# EAGLE design Output_v1_0 (EAGLE 9.6.2)
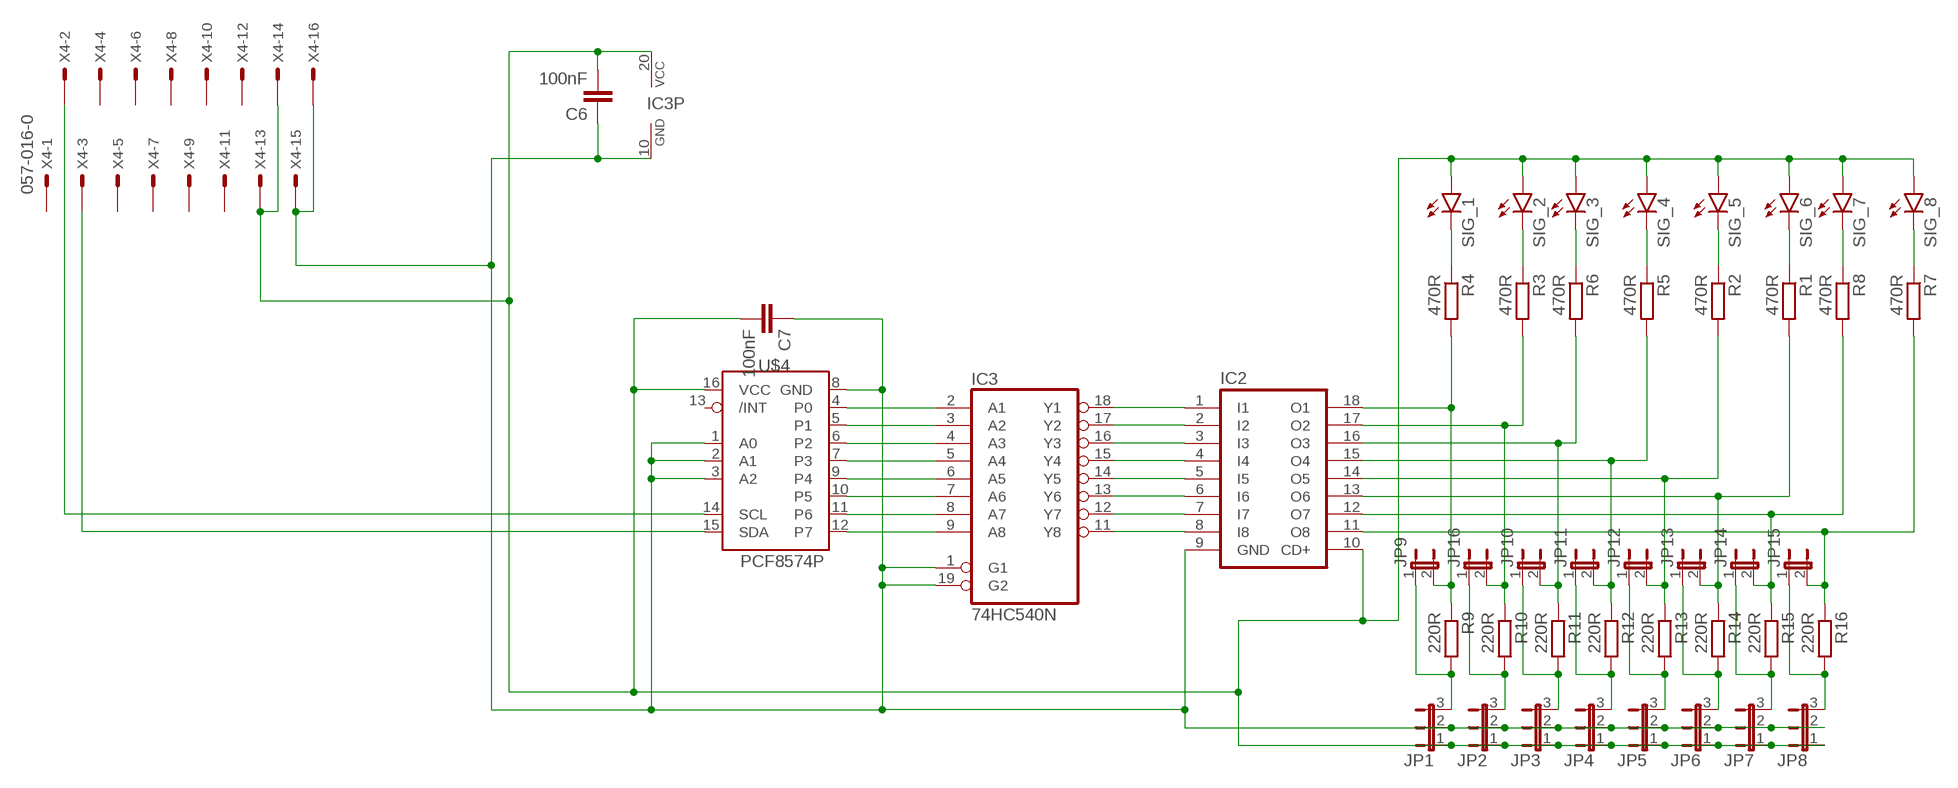
[diagram p0: schematic, sheet 1]

## Parts
C6  100nF  C-EU025-024X044  [C025-024X044]
C7  100nF  C-EU025-024X044  [C025-024X044]
IC2  ULN2803A  [DIL18]
IC3  74HC540N  [DIL20]
JP1  JP2E  [JP2]
JP2  JP2E  [JP2]
JP3  JP2E  [JP2]
JP4  JP2E  [JP2]
JP5  JP2E  [JP2]
JP6  JP2E  [JP2]
JP7  JP2E  [JP2]
JP8  JP2E  [JP2]
JP9  JP1E  [JP1]
JP10  JP1E  [JP1]
JP11  JP1E  [JP1]
JP12  JP1E  [JP1]
JP13  JP1E  [JP1]
JP14  JP1E  [JP1]
JP15  JP1E  [JP1]
JP16  JP1E  [JP1]
R1  470R  R-EU_0309/10  [0309/10]
R2  470R  R-EU_0309/10  [0309/10]
R3  470R  R-EU_0309/10  [0309/10]
R4  470R  R-EU_0309/10  [0309/10]
R5  470R  R-EU_0309/10  [0309/10]
R6  470R  R-EU_0309/10  [0309/10]
R7  470R  R-EU_0309/10  [0309/10]
R8  470R  R-EU_0309/10  [0309/10]
R9  220R  R-EU_0309/10  [0309/10]
R10  220R  R-EU_0309/10  [0309/10]
R11  220R  R-EU_0309/10  [0309/10]
R12  220R  R-EU_0309/10  [0309/10]
R13  220R  R-EU_0309/10  [0309/10]
R14  220R  R-EU_0309/10  [0309/10]
R15  220R  R-EU_0309/10  [0309/10]
R16  220R  R-EU_0309/10  [0309/10]
SIG_1  LED3MM  [LED3MM]
SIG_2  LED3MM  [LED3MM]
SIG_3  LED3MM  [LED3MM]
SIG_4  LED3MM  [LED3MM]
SIG_5  LED3MM  [LED3MM]
SIG_6  LED3MM  [LED3MM]
SIG_7  LED3MM  [LED3MM]
SIG_8  LED3MM  [LED3MM]
U$4  PCF8574P  [DIL16]
X4  057-016-0  [057-016-0]

## Nets
GND1: C6.1 C7.1 IC2.9(GND) IC3.1(G1) IC3.10(GND) IC3.19(G2) JP1.2 JP2.2 JP3.2 JP4.2 JP5.2 JP6.2 JP7.2 JP8.2 U$4.1(A0) U$4.2(A1) U$4.3(A2) U$4.8(GND) X4.15 X4.16
N$1: JP1.3 JP9.1 R9.2
N$2: IC2.13(O6) JP13.2 R1.2 R14.1
N$3: R2.1 SIG_5.K(C)
N$4: R1.1 SIG_6.K(C)
N$5: IC2.12(O7) JP14.2 R8.2 R15.1
N$6: U$4.15(SDA) X4.3
N$7: R8.1 SIG_7.K(C)
N$8: R7.1 SIG_8.K(C)
N$9: JP2.3 JP16.1 R10.2
N$10: JP3.3 JP10.1 R11.2
N$11: JP4.3 JP11.1 R12.2
N$12: IC2.8(I8) IC3.11(Y8)
N$13: JP5.3 JP12.1 R13.2
N$14: IC2.7(I7) IC3.12(Y7)
N$15: IC2.6(I6) IC3.13(Y6)
N$16: IC2.5(I5) IC3.14(Y5)
N$17: IC2.4(I4) IC3.15(Y4)
N$18: IC2.3(I3) IC3.16(Y3)
N$19: IC2.2(I2) IC3.17(Y2)
N$20: IC2.1(I1) IC3.18(Y1)
N$21: IC3.2(A1) U$4.4(P0)
N$22: IC3.3(A2) U$4.5(P1)
N$23: IC3.4(A3) U$4.6(P2)
N$24: IC3.5(A4) U$4.7(P3)
N$25: IC3.6(A5) U$4.9(P4)
N$26: IC3.7(A6) U$4.10(P5)
N$27: IC3.8(A7) U$4.11(P6)
N$28: IC3.9(A8) U$4.12(P7)
N$29: IC2.18(O1) JP9.2 R4.2 R9.1
N$30: JP6.3 JP13.1 R14.2
N$31: IC2.17(O2) JP16.2 R3.2 R10.1
N$32: JP7.3 JP14.1 R15.2
N$33: JP8.3 JP15.1 R16.2
N$35: U$4.14(SCL) X4.2
N$36: R4.1 SIG_1.K(C)
N$37: R3.1 SIG_2.K(C)
N$38: IC2.11(O8) JP15.2 R7.2 R16.1
N$41: IC2.16(O3) JP10.2 R6.2 R11.1
N$42: IC2.15(O4) JP11.2 R5.2 R12.1
N$43: IC2.14(O5) JP12.2 R2.2 R13.1
N$53: R6.1 SIG_3.K(C)
N$54: R5.1 SIG_4.K(C)
VCC5.0: C6.2 C7.2 IC2.10(CD+) IC3.20(VCC) JP1.1 JP2.1 JP3.1 JP4.1 JP5.1 JP6.1 JP7.1 JP8.1 SIG_1.A SIG_2.A SIG_3.A SIG_4.A SIG_5.A SIG_6.A SIG_7.A SIG_8.A U$4.16(VCC) X4.13 X4.14
Unconnected: U$4.13(/INT) X4.1 X4.4 X4.5 X4.6 X4.7 X4.8 X4.9 X4.10 X4.11 X4.12

## Library data of the parts
C6 C7 = resistor:C-EU: CAPACITOR, European symbol
IC2 = uln-udn:ULN2803A: DRIVER ARRAY
IC3 = 74xx-eu:74*540: Inverting Octal BUFFER and LINE DRIVER, 3-state
JP1-JP8 = jumper:JP2E: JUMPER
JP9-JP16 = jumper:JP1E: JUMPER
R1-R16 = resistor:R-EU_: RESISTOR, European symbol
SIG_1-SIG_8 = led:LED: LED OSRAM: - CHIPLED LG R971, LG N971, LY N971, LG Q971, LY Q971, LO R971, LY R971 LH N974, LH R974 LS Q976, LO Q976, LY Q976 LO Q996 - Hyper CHIPLED LW Q18S LB Q993, LB Q99A, LB R99A - SideLED LS A670, LO A670, LY A670, LG A670, LP A670 LB A673, LV A673, LT A673, LW A673 LH A674 LY A675 LS A676, LA A676, LO A676, LY A676, LW A676 LS A679, LY A679, LG A679 - Hyper Micro SIDELED® LS Y876, LA Y876, LO Y876, LY Y876 LT Y87S - SmartLED LW L88C, LW L88S LB L89C, LB L89S, LG L890 LS L89K, LO L89K, LY L89K LS L896, LA L896, LO L896, LY L896 - TOPLED LS T670, LO T670, LY T670, LG T670, LP T670 LSG T670, LSP T670, LSY T670, LOP T670, LYG T670 LG T671, LOG T671, LSG T671 LB T673, LV T673, LT T673, LW T673 LH T674 LS T676, LA T676, LO T676, LY T676, LB T676, LH T676, LSB T676, LW T676 LB T67C, LV T67C, LT T67C, LS T67K, LO T67K, LY T67K, LW E67C LS E67B, LA E67B, LO E67B, LY E67B, LB E67C, LV E67C, LT E67C LW T67C LS T679, LY T679, LG T679 LS T770, LO T770, LY T770, LG T770, LP T770 LB T773, LV T773, LT T773, LW T773 LH T774 LS E675, LA E675, LY E675, LS T675 LS T776, LA T776, LO T776, LY T776, LB T776 LHGB T686 LT T68C, LB T68C - Hyper Mini TOPLED® LB M676 - Mini TOPLED Santana® LG M470 LS M47K, LO M47K, LY M47K Source: http://www.osram.convergy.de LUXEON: - LUMILED® LXK2-PW12-R00, LXK2-PW12-S00, LXK2-PW14-U00, LXK2-PW14-V00 LXK2-PM12-R00, LXK2-PM12-S00, LXK2-PM14-U00 LXK2-PE12-Q00, LXK2-PE12-R00, LXK2-PE12-S00, LXK2-PE14-T00, LXK2-PE14-U00 LXK2-PB12-K00, LXK2-PB12-L00, LXK2-PB12-M00, LXK2-PB14-N00, LXK2-PB14-P00, LXK2-PB14-Q00 LXK2-PR12-L00, LXK2-PR12-M00, LXK2-PR14-Q00, LXK2-PR14-R00 LXK2-PD12-Q00, LXK2-PD12-R00, LXK2-PD12-S00 LXK2-PH12-R00, LXK2-PH12-S00 LXK2-PL12-P00, LXK2-PL12-Q00, LXK2-PL12-R00 Source: www.luxeon.com KINGBRIGHT: KA-3528ASYC Source: www.kingbright.com
U$4 = i2c:PCF8574: Remote 8-Bit I/O Expander for I²C Bus
X4 = con-panduit:057-016-: CONNECTOR 10-pin series 057 contact pc board low profile headers; OC_FARNELL: unknown; OC_NEWARK: unknown

## Board
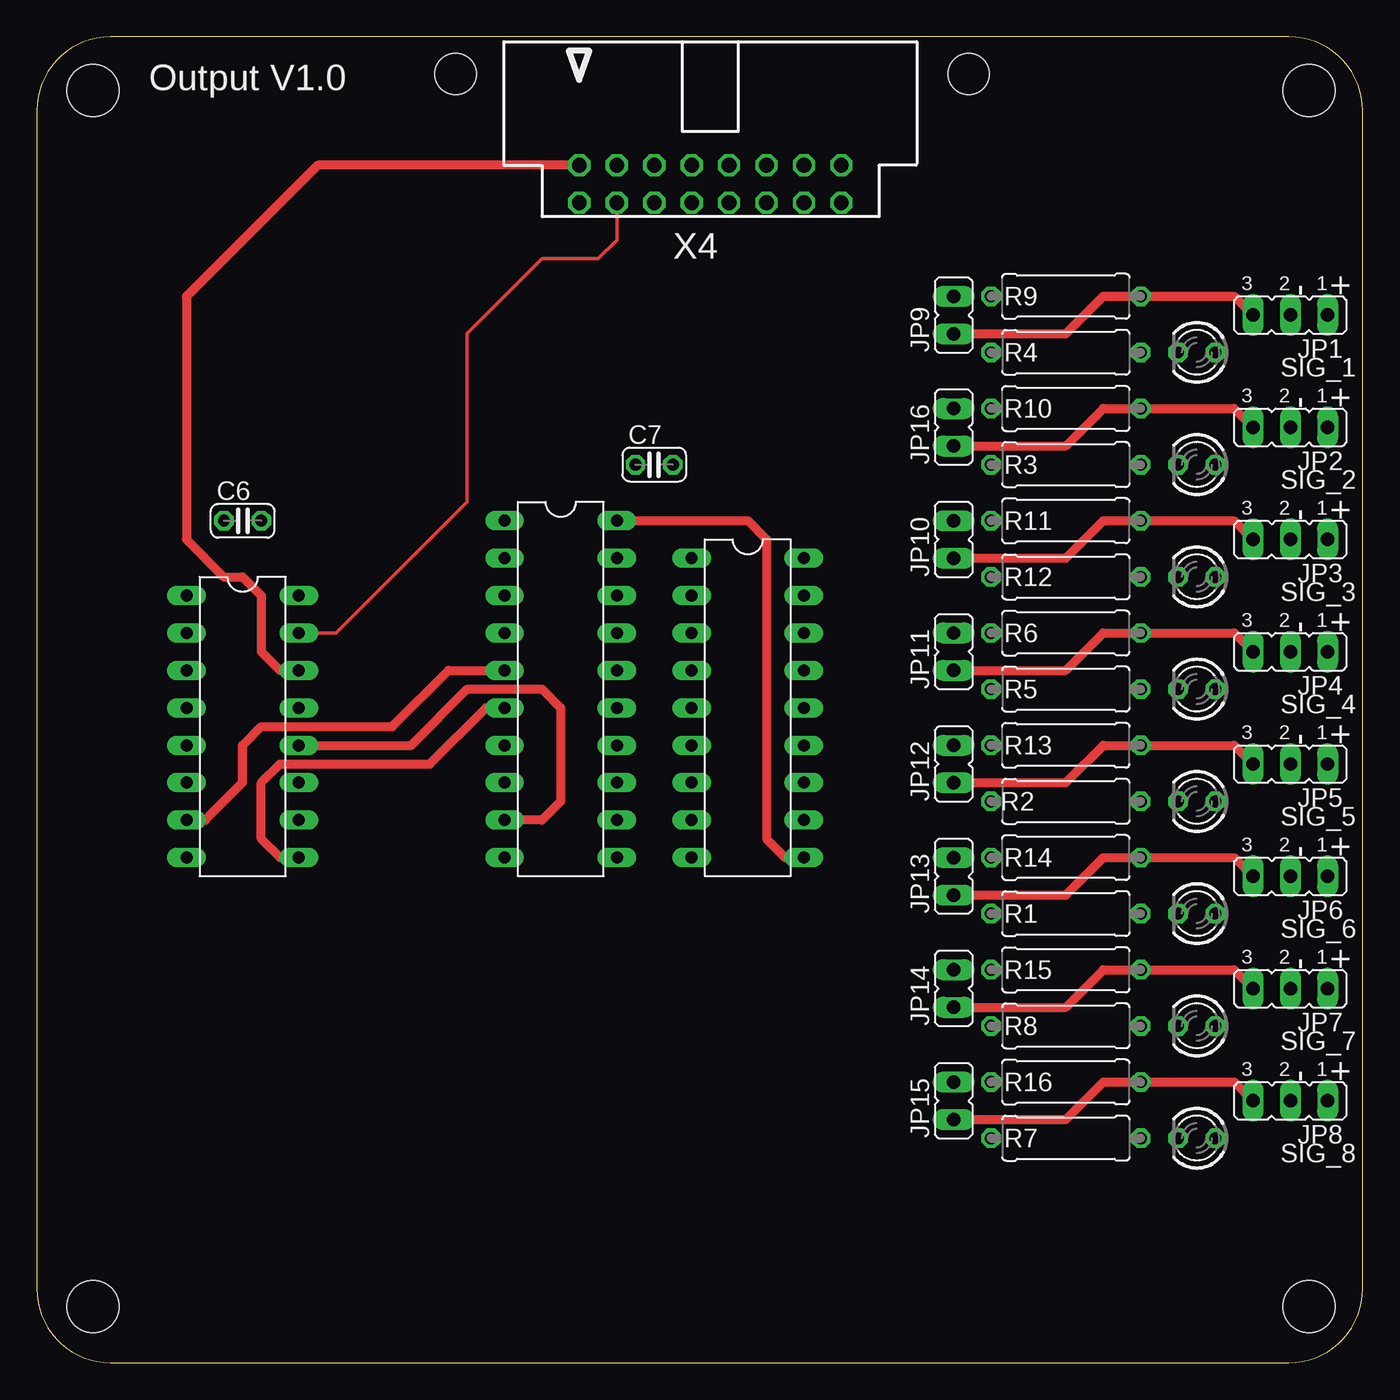
[diagram p1: board, top side]
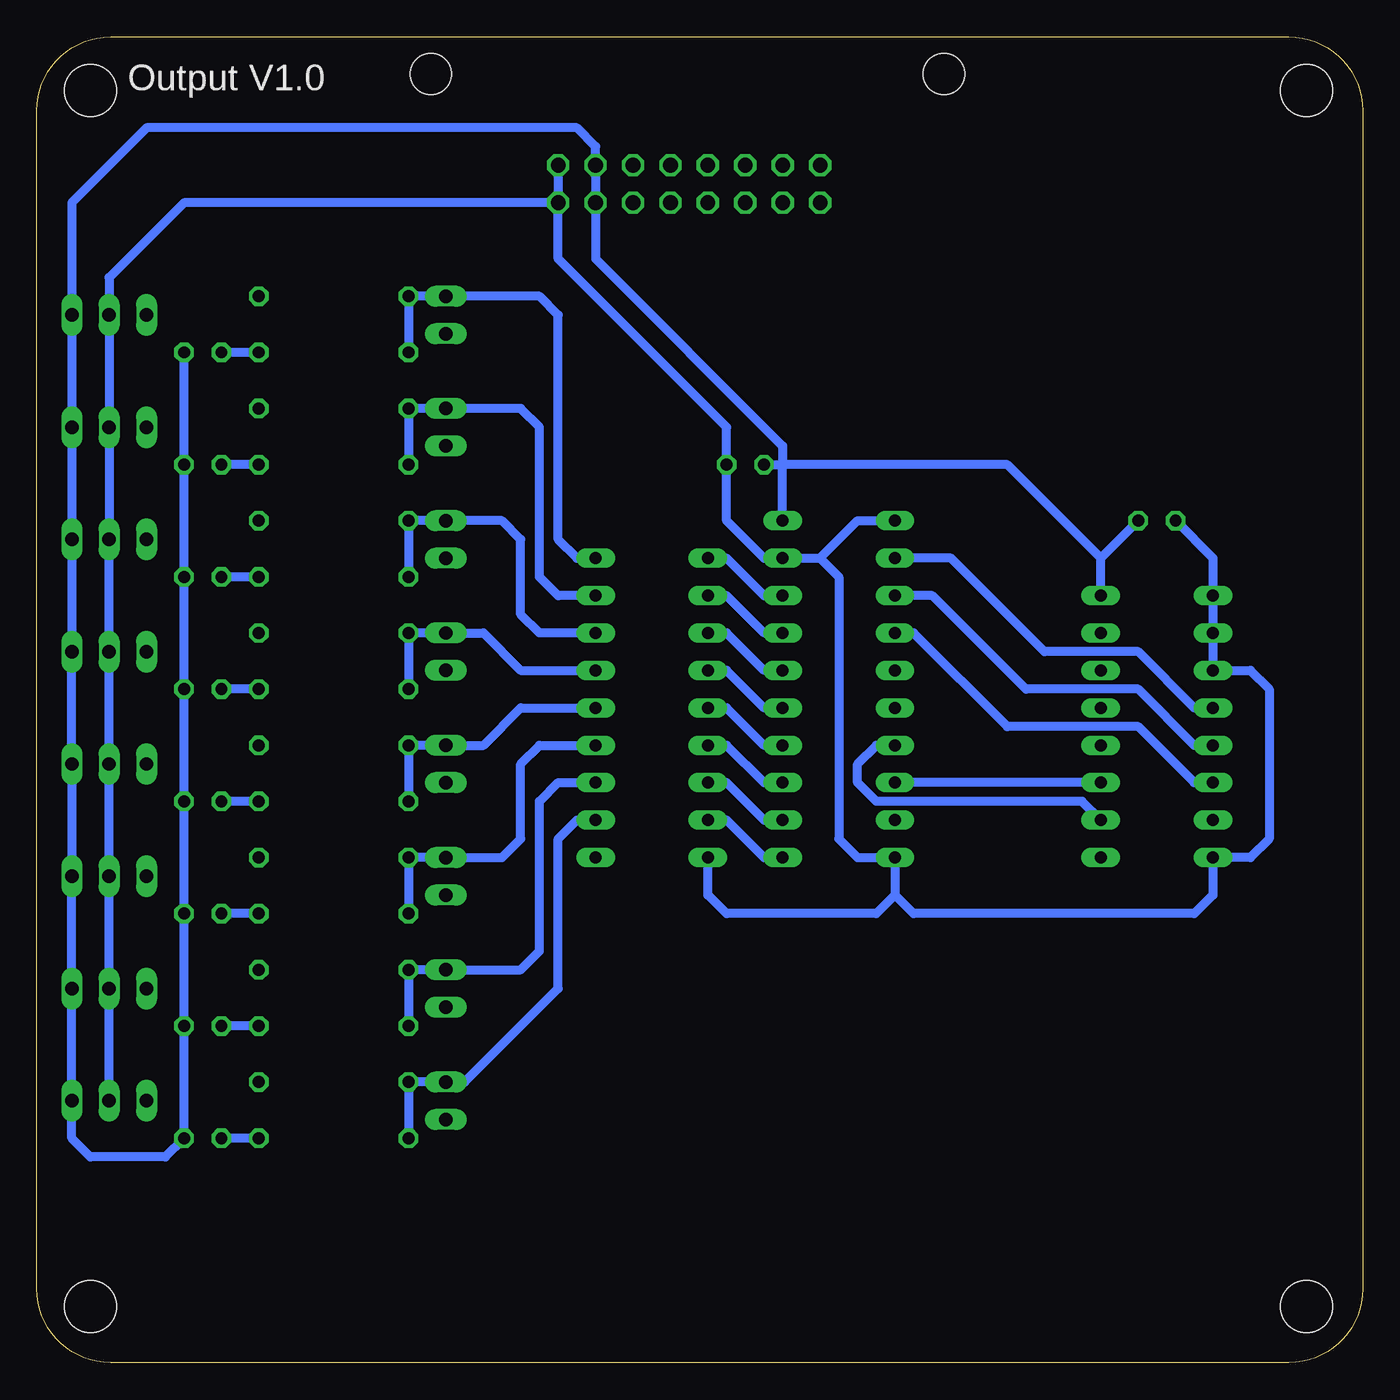
[diagram p2: board, bottom side, seen from below]

Size 90 x 90 mm. Coordinates in mm from the lower left corner, seen from the top.
Outline: 0,85 0,5 arc90 5,0 85,0 arc90 90,5 90,85 arc90 85,90 5,90 arc90 0,85
Copper layers (1*16): Top 0.035mm / dielectric 1.5mm / Bottom 0.035mm
Design rules "default": minimum track width 6mil, minimum drill 0.35mm, track to track 6mil, track to pad 6mil, pad to pad 6mil, via to via 6mil, smd to smd 6mil, copper to edge 40mil, drill to drill 6mil, minimum pad ring 10mil, minimum via ring 8mil, stop-mask expansion 4mil, vias tented up to drill 0mil, thermal gap 10mil
Holes 3.5 mm at 86.36,86.36 3.81,86.36 3.81,3.81 86.36,3.81

### Footprints (pad centres in the part's own frame; a part is rotated, then mirrored left to right if it is on the bottom)
C025-024X044 = drill 0.813 octagon: 1 -1.27,0; 2 1.27,0
DIL18 = drill 0.813 long: 1 -10.16,-3.81; 2 -7.62,-3.81; 3 -5.08,-3.81; 4 -2.54,-3.81; 5 0,-3.81; 6 2.54,-3.81; 7 5.08,-3.81; 8 7.62,-3.81; 9 10.16,-3.81; 10 10.16,3.81; 11 7.62,3.81; 12 5.08,3.81; 13 2.54,3.81; 14 0,3.81; 15 -2.54,3.81; 16 -5.08,3.81; 17 -7.62,3.81; 18 -10.16,3.81
DIL20 = drill 0.813 long: 1 -11.43,-3.81; 2 -8.89,-3.81; 3 -6.35,-3.81; 4 -3.81,-3.81; 5 -1.27,-3.81; 6 1.27,-3.81; 7 3.81,-3.81; 8 6.35,-3.81; 9 8.89,-3.81; 10 11.43,-3.81; 11 11.43,3.81; 12 8.89,3.81; 13 6.35,3.81; 14 3.81,3.81; 15 1.27,3.81; 16 -1.27,3.81; 17 -3.81,3.81; 18 -6.35,3.81; 19 -8.89,3.81; 20 -11.43,3.81
JP2 = drill 0.914 long: 1 -2.54,0; 2 0,0; 3 2.54,0
JP1 = drill 0.914 long: 1 0,-1.27; 2 0,1.27
0309/10 = drill 0.813 octagon: 1 -5.08,0; 2 5.08,0
LED3MM = drill 0.813 octagon: A -1.27,0; K 1.27,0
DIL16 = drill 0.813 long: 1 -8.89,-3.81; 2 -6.35,-3.81; 3 -3.81,-3.81; 4 -1.27,-3.81; 5 1.27,-3.81; 6 3.81,-3.81; 7 6.35,-3.81; 8 8.89,-3.81; 9 8.89,3.81; 10 6.35,3.81; 11 3.81,3.81; 12 1.27,3.81; 13 -1.27,3.81; 14 -3.81,3.81; 15 -6.35,3.81; 16 -8.89,3.81
057-016-0 = drill 1 octagon: 1 -8.89,-5.08; 2 -8.89,-2.54; 3 -6.35,-5.08; 4 -6.35,-2.54; 5 -3.81,-5.08; 6 -3.81,-2.54; 7 -1.27,-5.08; 8 -1.27,-2.54; 9 1.27,-5.08; 10 1.27,-2.54; 11 3.81,-5.08; 12 3.81,-2.54; 13 6.35,-5.08; 14 6.35,-2.54; 15 8.89,-5.08; 16 8.89,-2.54 | hole 2.8: -17.29,3.66; 17.54,3.66

### Placement (x,y rotation side)
C6  13.97,57.15 0 top
C7  41.91,60.96 180 top
IC2  48.26,44.45 270 top
IC3  35.56,45.72 270 top
JP1  85.09,71.12 180 top
JP2  85.09,63.5 180 top
JP3  85.09,55.88 180 top
JP4  85.09,48.26 180 top
JP5  85.09,40.64 180 top
JP6  85.09,33.02 180 top
JP7  85.09,25.4 180 top
JP8  85.09,17.78 180 top
JP9  62.23,71.12 0 top
JP10  62.23,55.88 0 top
JP11  62.23,48.26 0 top
JP12  62.23,40.64 0 top
JP13  62.23,33.02 0 top
JP14  62.23,25.4 0 top
JP15  62.23,17.78 0 top
JP16  62.23,63.5 0 top
R1  69.85,30.48 180 top
R2  69.85,38.1 180 top
R3  69.85,60.96 180 top
R4  69.85,68.58 180 top
R5  69.85,45.72 180 top
R6  69.85,53.34 180 top
R7  69.85,15.24 180 top
R8  69.85,22.86 180 top
R9  69.85,72.39 0 top
R10  69.85,64.77 0 top
R11  69.85,57.15 0 top
R12  69.85,49.53 0 top
R13  69.85,41.91 0 top
R14  69.85,34.29 0 top
R15  69.85,26.67 0 top
R16  69.85,19.05 0 top
SIG_1  78.74,68.58 180 top
SIG_2  78.74,60.96 180 top
SIG_3  78.74,53.34 180 top
SIG_4  78.74,45.72 180 top
SIG_5  78.74,38.1 180 top
SIG_6  78.74,30.48 180 top
SIG_7  78.74,22.86 180 top
SIG_8  78.74,15.24 180 top
U$4  13.97,43.18 270 top
X4  45.72,83.82 0 top

### Tracks (layer width: path | path; a pad name or v marks a point on that pad's centre or on a via)
GND1
  Bottom 0.61: JP8.2 JP7.2 JP6.2 JP5.2 JP4.2 JP3.2 JP2.2 JP1.2 85.09,73.66 80.01,78.74 X4.15 | X4.16 X4.15 | X4.15 54.61,74.93 43.18,63.5 C7.1 43.18,57.15 40.64,54.61 IC3.19 36.83,54.61 | C6.1 10.16,54.61 U$4.1 U$4.2 U$4.3 7.62,46.99 6.35,45.72 6.35,35.56 7.62,34.29 U$4.8 10.16,31.75 11.43,30.48 30.48,30.48 31.75,31.75 | 31.75,31.75 IC3.10 34.29,34.29 35.56,35.56 35.56,53.34 36.83,54.61 | 31.75,31.75 33.02,30.48 43.18,30.48 44.45,31.75 IC2.9 | 36.83,54.61 34.29,57.15 IC3.1
N$1
  Top 0.61: JP9.1 69.85,69.85 72.39,72.39 R9.2 81.28,72.39 JP1.3
N$2
  Bottom 0.61: R1.2 R14.1 JP13.2 58.42,34.29 57.15,35.56 57.15,40.64 55.88,41.91 IC2.13
N$3
  Bottom 0.61: R2.1 SIG_5.K
N$4
  Bottom 0.61: R1.1 SIG_6.K
N$5
  Bottom 0.61: R8.2 R15.1 JP14.2 57.15,26.67 55.88,27.94 55.88,38.1 54.61,39.37 IC2.12
N$6
  Top 0.254: U$4.15 20.32,49.53 29.21,58.42 29.21,69.85 34.29,74.93 38.1,74.93 39.37,76.2 X4.3
N$7
  Bottom 0.61: R8.1 SIG_7.K
N$8
  Bottom 0.61: R7.1 SIG_8.K
N$9
  Top 0.61: JP16.1 69.85,62.23 72.39,64.77 R10.2 81.28,64.77 JP2.3
N$10
  Top 0.61: JP10.1 69.85,54.61 72.39,57.15 R11.2 81.28,57.15 JP3.3
N$11
  Top 0.61: JP11.1 69.85,46.99 72.39,49.53 R12.2 81.28,49.53 JP4.3
N$12
  Bottom 0.61: IC3.11 40.64,34.29 43.18,36.83 IC2.8
N$13
  Top 0.61: JP12.1 69.85,39.37 72.39,41.91 R13.2 81.28,41.91 JP5.3
N$14
  Bottom 0.61: IC3.12 40.64,36.83 43.18,39.37 IC2.7
N$15
  Bottom 0.61: IC3.13 40.64,39.37 43.18,41.91 IC2.6
N$16
  Bottom 0.61: IC3.14 40.64,41.91 43.18,44.45 IC2.5
N$17
  Bottom 0.61: IC3.15 40.64,44.45 43.18,46.99 IC2.4
N$18
  Bottom 0.61: IC3.16 40.64,46.99 43.18,49.53 IC2.3
N$19
  Bottom 0.61: IC3.17 40.64,49.53 43.18,52.07 IC2.2
N$20
  Bottom 0.61: IC3.18 40.64,52.07 43.18,54.61 IC2.1
N$21
  Bottom 0.61: IC3.2 27.94,54.61 21.59,48.26 15.24,48.26 11.43,44.45 U$4.4
N$22
  Bottom 0.61: IC3.3 29.21,52.07 22.86,45.72 15.24,45.72 11.43,41.91 U$4.5
N$23
  Bottom 0.61: U$4.6 11.43,39.37 15.24,43.18 24.13,43.18 30.48,49.53 IC3.4
N$24
  Top 0.61: U$4.7 11.43,36.83 13.97,39.37 13.97,41.91 15.24,43.18 24.13,43.18 27.94,46.99 IC3.5
N$25
  Top 0.61: U$4.9 16.51,34.29 15.24,35.56 15.24,39.37 16.51,40.64 26.67,40.64 30.48,44.45 IC3.6
N$26
  Bottom 0.61: U$4.10 19.05,38.1 33.02,38.1 34.29,39.37 34.29,40.64 33.02,41.91 IC3.7
N$27
  Bottom 0.61: U$4.11 IC3.8
N$28
  Top 0.61: U$4.12 25.4,41.91 29.21,45.72 34.29,45.72 35.56,44.45 35.56,38.1 34.29,36.83 IC3.9
N$29
  Bottom 0.61: R4.2 R9.1 JP9.2 55.88,72.39 54.61,71.12 54.61,55.88 53.34,54.61 IC2.18
N$30
  Top 0.61: JP13.1 69.85,31.75 72.39,34.29 R14.2 81.28,34.29 JP6.3
N$31
  Bottom 0.61: R3.2 R10.1 JP16.2 57.15,64.77 55.88,63.5 55.88,53.34 54.61,52.07 IC2.17
N$32
  Top 0.61: JP14.1 69.85,24.13 72.39,26.67 R15.2 81.28,26.67 JP7.3
N$33
  Top 0.61: JP15.1 69.85,16.51 72.39,19.05 R16.2 81.28,19.05 JP8.3
N$35
  Top 0.61: X4.2 19.05,81.28 10.16,72.39 10.16,55.88 12.7,53.34 13.97,53.34 15.24,52.07 15.24,48.26 16.51,46.99 U$4.14
N$36
  Bottom 0.61: R4.1 SIG_1.K
N$37
  Bottom 0.61: R3.1 SIG_2.K
N$38
  Bottom 0.61: R7.2 R16.1 JP15.2 60.96,19.05 54.61,25.4 54.61,35.56 53.34,36.83 IC2.11
N$41
  Bottom 0.61: R6.2 R11.1 JP10.2 58.42,57.15 57.15,55.88 57.15,50.8 55.88,49.53 IC2.16
N$42
  Bottom 0.61: R5.2 R12.1 JP11.2 59.69,49.53 57.15,46.99 IC2.15
N$43
  Bottom 0.61: R2.2 R13.1 JP12.2 59.69,41.91 57.15,44.45 IC2.14
N$53
  Bottom 0.61: R6.1 SIG_3.K
N$54
  Bottom 0.61: R5.1 SIG_4.K
VCC5.0
  Top 0.61: IC3.20 48.26,57.15 49.53,55.88 49.53,35.56 50.8,34.29 IC2.10
  Bottom 0.61: SIG_1.A SIG_2.A SIG_3.A SIG_4.A SIG_5.A SIG_6.A SIG_7.A SIG_8.A 81.28,13.97 86.36,13.97 87.63,15.24 JP8.1 JP7.1 JP6.1 JP5.1 JP4.1 JP3.1 JP2.1 JP1.1 87.63,78.74 82.55,83.82 53.34,83.82 52.07,82.55 X4.14 X4.13 52.07,74.93 39.37,62.23 39.37,60.96 | C7.2 39.37,60.96 | C6.2 17.78,54.61 | IC3.20 39.37,60.96 | U$4.16 17.78,54.61 | 39.37,60.96 24.13,60.96 17.78,54.61

### Text on the board
tNames: Output V1.0 | - | + | - | + | - | + | - | + | - | + | - | + | - | + | - | +
bNames: Output V1.0